# Altium project elstm32f405_core.PrjPCB
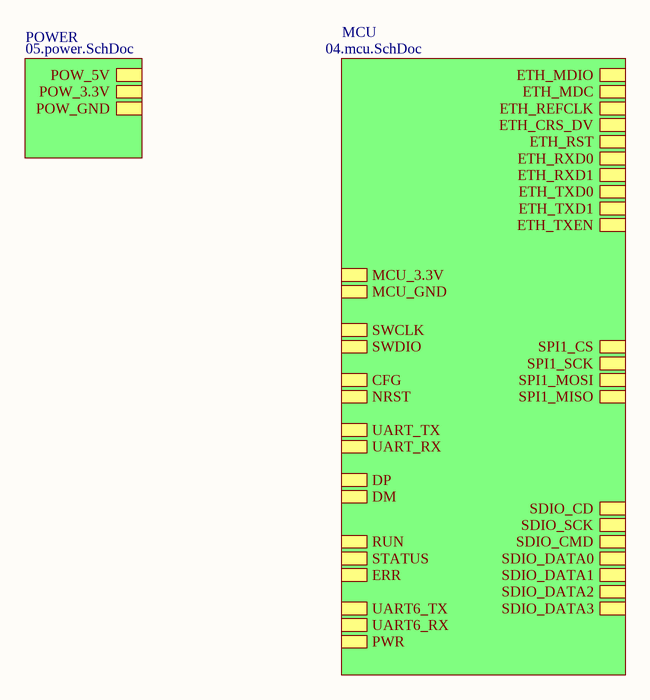
[diagram p0: 03.main.SchDoc]
5 sheets, 35 parts. Net scope: hierarchical (ports join the sheet entries above them; power ports are global).
Sheets:
  03.main.SchDoc
    MCU = 04.mcu.SchDoc
    POWER = 05.power.SchDoc
  06.other.SchDoc
  01.Block Diagram.SchDoc

## Sheet 03.main.SchDoc
size A4

### Sub-sheets
MCU = 04.mcu.SchDoc: SPI1_CS, SPI1_SCK, SPI1_MOSI, SPI1_MISO, SWCLK, SWDIO, CFG, NRST, DP, DM, UART_TX, UART_RX, SDIO_CD, SDIO_SCK, SDIO_CMD, SDIO_DATA0, SDIO_DATA1, SDIO_DATA2, SDIO_DATA3, RUN, ERR, STATUS, MCU_3.3V, MCU_GND, ETH_MDIO, ETH_MDC, ETH_CRS_DV, ETH_RST, ETH_RXD0, ETH_RXD1, ETH_TXD0, ETH_TXD1, ETH_TXEN, ETH_REFCLK, UART6_TX, UART6_RX, PWR
POWER = 05.power.SchDoc: POW_5V, POW_3.3V, POW_GND

### Nets
GND: sheet MCU/MCU_GND, sheet POWER/POW_GND

### Notes on the sheet
- #
- 日期
- 描述
- DESIGN BY
- 设计人员
- 设计日期
- 图纸名称
- 图纸描述
- EasyLinker Develop Team
- 审核人员
- 审核日期
- 产品名称
- 产品型号
- 图纸版本
- /
- A4

## Sheet 04.mcu.SchDoc
size A4
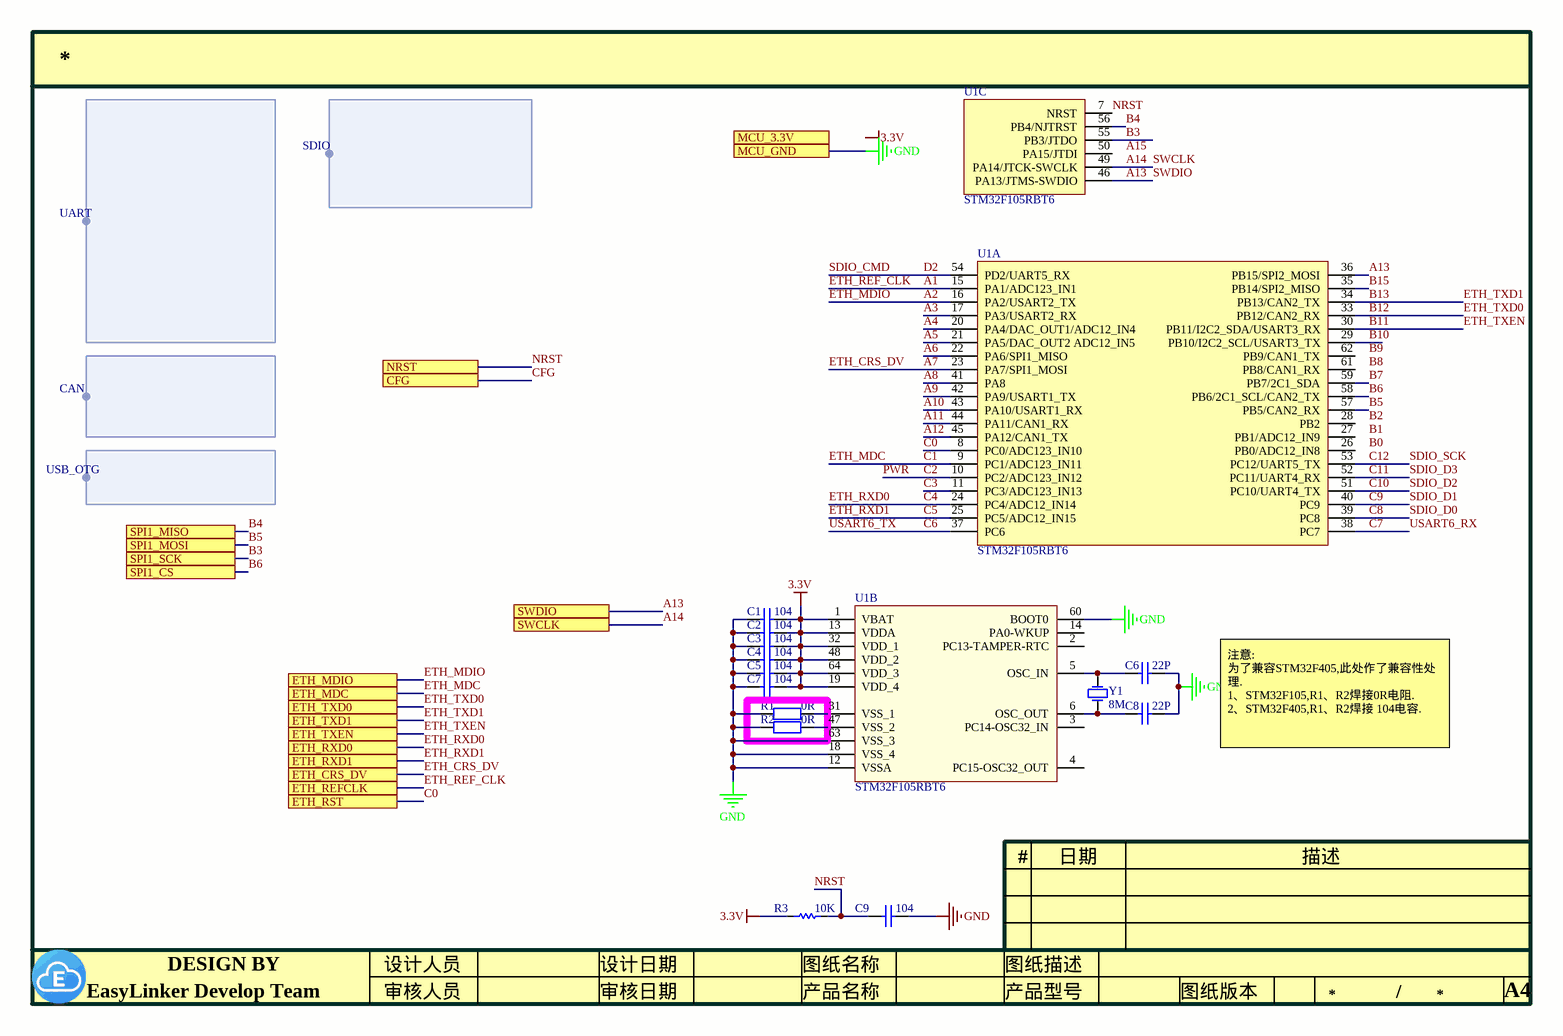
[diagram p1: 04.mcu.SchDoc]

### Parts
C1  104  [0603C]
C2  104  [0603C]
C3  104  [0603C]
C4  104  [0603C]
C5  104  [0603C]
C6  22P  [0603C]
C7  104  [0603C]
C8  22P  [0603C]
C9  104  [0603C]
R1  value 0R  [0603R]  (hidden comment: Res2)
R2  value 0R  [0603R]  (hidden comment: Res2)
R3  10K  [0603R]
U1  STM32F105RBT6  [S-PQFP-G64_Y]  (parts A,B,C of 3)
Y1  8M  [XTAL_SMD_5X3]

### Ports
CAN1_RX, CAN1_TX, CAN2_RX, CAN2_TX, CFG, DM (out), DP (out), ETH_CRS_DV, ETH_MDC, ETH_MDIO, ETH_REFCLK, ETH_RST, ETH_RXD0, ETH_RXD1, ETH_TXD0, ETH_TXD1, ETH_TXEN, MCU_3.3V, MCU_GND, NRST, SDIO_CD, SDIO_CMD, SDIO_DATA0, SDIO_DATA1, SDIO_DATA2, SDIO_DATA3, SDIO_SCK, SPI1_CS, SPI1_MISO, SPI1_MOSI, SPI1_SCK, SWCLK, SWDIO, UART1_RX, UART1_TX, UART2_RX, UART2_TX, UART3_RX, UART3_TX, UART4_RX, UART4_TX, UART5_RX, UART5_TX, UART6_RX, UART6_TX

### Harnesses
UART: 
CAN: 
USB_OTG: 
SDIO: 

### Nets
3.3V: C1.1 C2.1 C3.1 C4.1 C5.1 C7.1 R3.1 U1.1(VBAT) U1.13(VDDA) U1.19(VDD_4) U1.32(VDD_1) U1.48(VDD_2) U1.64(VDD_3)
GND: C1.2 C2.2 C3.2 C4.2 C5.2 C6.1 C7.2 C8.1 C9.1 R1.2 R2.2 U1.12(VSSA) U1.18(VSS_4) U1.60(BOOT0) U1.63(VSS_3) ; port MCU_GND
A1: U1.15(PA1/ADC123_IN1) ; port ETH_REFCLK  [also labelled ETH_REF_CLK]
A2: U1.16(PA2/USART2_TX) ; port ETH_MDIO, port UART2_TX  [also labelled ETH_MDIO]
A3: U1.17(PA3/USART2_RX) ; port UART2_RX
A4: U1.20(PA4/DAC_OUT1/ADC12_IN4)
A5: U1.21(PA5/DAC_OUT2_ADC12_IN5)
A6: U1.22(PA6/SPI1_MISO)
A7: U1.23(PA7/SPI1_MOSI) ; port ETH_CRS_DV  [also labelled ETH_CRS_DV]
A8: U1.41(PA8)
A9: U1.42(PA9/USART1_TX) ; port UART1_TX
A10: U1.43(PA10/USART1_RX) ; port UART1_RX
A11: U1.44(PA11/CAN1_RX) ; port DM
A12: U1.45(PA12/CAN1_TX) ; port DP
A13: U1.36(PB15/SPI2_MOSI) U1.46(PA13/JTMS-SWDIO) ; port SWDIO  [also labelled SWDIO]
A14: U1.49(PA14/JTCK-SWCLK) ; port SWCLK  [also labelled SWCLK]
B3: U1.55(PB3/JTDO) ; port SPI1_SCK
B4: U1.56(PB4/NJTRST) ; port SPI1_MISO
B5: U1.57(PB5/CAN2_RX) ; port SPI1_MOSI, port CAN2_RX
B6: U1.58(PB6/2C1_SCL/CAN2_TX) ; port SPI1_CS, port CAN2_TX
B7: U1.59(PB7/2C1_SDA)
B8: port CAN1_RX
B9: port CAN1_TX
B10: U1.29(PB10/I2C2_SCL/USART3_TX) ; port UART3_TX
B11: U1.30(PB11/I2C2_SDA/USART3_RX) ; port ETH_TXEN, port UART3_RX  [also labelled ETH_TXEN]
B12: U1.33(PB12/CAN2_RX) ; port ETH_TXD0  [also labelled ETH_TXD0]
B13: U1.34(PB13/CAN2_TX) ; port ETH_TXD1  [also labelled ETH_TXD1]
B15: U1.35(PB14/SPI2_MISO)
C0: U1.8(PC0/ADC123_IN10) ; port ETH_RST
C1: U1.9(PC1/ADC123_IN11) ; port ETH_MDC  [also labelled ETH_MDC]
C2: U1.10(PC2/ADC123_IN12) ; port SDIO_CD  [also labelled PWR]
C3: U1.11(PC3/ADC123_IN13)
C4: U1.24(PC4/ADC12_IN14) ; port ETH_RXD0  [also labelled ETH_RXD0]
C5: U1.25(PC5/ADC12_IN15) ; port ETH_RXD1  [also labelled ETH_RXD1]
C6: U1.37(PC6) ; port UART6_TX  [also labelled USART6_TX]
C7: U1.38(PC7) ; port UART6_RX  [also labelled USART6_RX]
C8: U1.39(PC8) ; port SDIO_DATA0  [also labelled SDIO_D0]
C9: U1.40(PC9) ; port SDIO_DATA1  [also labelled SDIO_D1]
C10: U1.51(PC10/UART4_TX) ; port SDIO_DATA2, port UART4_TX  [also labelled SDIO_D2]
C11: U1.52(PC11/UART4_RX) ; port SDIO_DATA3, port UART4_RX  [also labelled SDIO_D3]
C12: U1.53(PC12/UART5_TX) ; port SDIO_SCK, port UART5_TX  [also labelled SDIO_SCK]
CFG: port CFG
D2: U1.54(PD2/UART5_RX) ; port SDIO_CMD, port UART5_RX  [also labelled SDIO_CMD]
NRST: C9.2 R3.2 U1.7(NRST) ; port NRST
NetC6_2: C6.2 U1.5(OSC_IN) Y1.1(OSC1)
NetC8_2: C8.2 U1.6(OSC_OUT) Y1.2(OSC2)
NetR1_1: R1.1 U1.31(VSS_1)
NetR2_1: R2.1 U1.47(VSS_2)

Not connected (* = marked no-connect by the designer): U1 2(PC13-TAMPER-RTC) 3(PC14-OSC32_IN) 4(PC15-OSC32_OUT) 14(PA0-WKUP) 26(PB0/ADC12_IN8) 27(PB1/ADC12_IN9) 28(PB2) 50(PA15/JTDI) 61(PB8/CAN1_RX) 62(PB9/CAN1_TX)

### Notes on the sheet
- 注意:
  为了兼容STM32F405,此处作了兼容性处理.
  1、STM32F105,R1、R2焊接0R电阻.
  2、STM32F405,R1、R2焊接 104电容.
- Labels drawn without touching a wire or pin: 3.3V, A15, B0, B1, B2, B8, B9
- #
- 日期
- 描述
- DESIGN BY
- 设计人员
- 设计日期
- 图纸名称
- 图纸描述
- EasyLinker Develop Team
- 审核人员
- 审核日期
- 产品名称
- 产品型号
- 图纸版本
- /
- A4

### Library data of the parts
C1-C9 = Cap: Capacitor; Published: 8-Jun-2000; LatestRevisionDate: 17-Jul-2002; LatestRevisionNote: Re-released for DXP Platform.; PackageReference: RAD-0.3; Publisher: Altium Limited; PackageDescription: Radial Cap, Thru-Hole; 2 Leads; 0.3 in Pin Spacing
  C1-C5 C7 C9: Value: 104
  C6 C8: Value: 22P
R1 R2 = Res2: Resistor; Published: 8-Jun-2000; LatestRevisionDate: 17-Jul-2002; LatestRevisionNote: Re-released for DXP Platform.; PackageReference: AXIAL-0.4; Publisher: Altium Limited; PackageDescription: Axial Device, Thru-Hole; 2 Leads; 0.4 in Pin Spacing
R3 = Res1: Resistor; Published: 8-Jun-2000; LatestRevisionDate: 17-Jul-2002; LatestRevisionNote: Re-released for DXP Platform.; PackageReference: AXIAL-0.3; Publisher: Altium Limited; PackageDescription: Axial Device, Thru-Hole; 2 Leads; 0.3 in Pin Spacing; Value: 10K
U1 = STM32F105xxx-64-QFP64
Y1 = XTAL: Crystal Oscillator; Published: 8-Jun-2000; LatestRevisionDate: 17-Jul-2002; LatestRevisionNote: Re-released for DXP Platform.; PackageReference: R38; Publisher: Altium Limited; PackageDescription: Crystal, Thru-Hole; 2 Leads; Body 3.1 x 8.2 mm (Dia.xH)

## Sheet 05.power.SchDoc
size A4
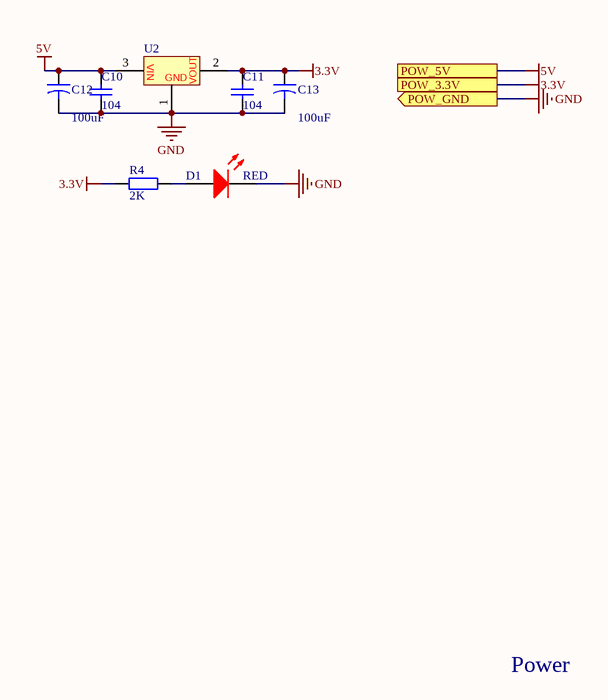
[diagram p2: 05.power.SchDoc]

### Parts
C10  104  [0603C]
C11  104  [0603C]
C12  value 100uF  [3216]  (hidden comment: Cap2)
C13  value 100uF  [3216]  (hidden comment: Cap2)
D1  RED  [0603led]
R4  value 2K  [0603R]  (hidden comment: Res2)
U2  (no value)  [sot-89]

### Ports
POW_3.3V, POW_5V, POW_GND (out)

### Nets
3.3V: C11.2 C13.1 R4.1 U2.2(VOUT) ; port POW_3.3V
5V: C10.2 C12.1 U2.3(VIN) ; port POW_5V
GND: C10.1 C11.1 C12.2 C13.2 D1.2 U2.1(GND) ; port POW_GND
NetD1_1: D1.1 R4.2

### Notes on the sheet
- Power
- #
- 日期
- 描述
- DESIGN BY
- 设计人员
- 设计日期
- 图纸名称
- 图纸描述
- EasyLinker Develop Team
- 审核人员
- 审核日期
- 产品名称
- 产品型号
- 图纸版本
- /
- A4

### Library data of the parts
C10 C11 = Cap: Capacitor; Published: 8-Jun-2000; LatestRevisionDate: 17-Jul-2002; LatestRevisionNote: Re-released for DXP Platform.; PackageReference: RAD-0.3; Publisher: Altium Limited; PackageDescription: Radial Cap, Thru-Hole; 2 Leads; 0.3 in Pin Spacing; Value: 104
C12 C13 = Cap2: Capacitor; Published: 23-Sep-2002; PackageReference: CAPR5-4X5; Publisher: Altium Limited; PackageDescription: Capacitor; 2 Leads
D1 = LED_RED: Typical RED; Published: 8-Jun-2000; LatestRevisionDate: 17-Jul-2002; LatestRevisionNote: Re-released for DXP Platform.; PackageVersion: Feb-2002; PackageReference: 3.2X1.6X1.1; Publisher: Altium Limited; PackageDescription: SM LED; 2 Flat Leads
R4 = Res2: Resistor; Published: 8-Jun-2000; LatestRevisionDate: 17-Jul-2002; LatestRevisionNote: Re-released for DXP Platform.; PackageReference: AXIAL-0.4; Publisher: Altium Limited; PackageDescription: Axial Device, Thru-Hole; 2 Leads; 0.4 in Pin Spacing
U2 = AMS1117

## Sheet 06.other.SchDoc
size A4
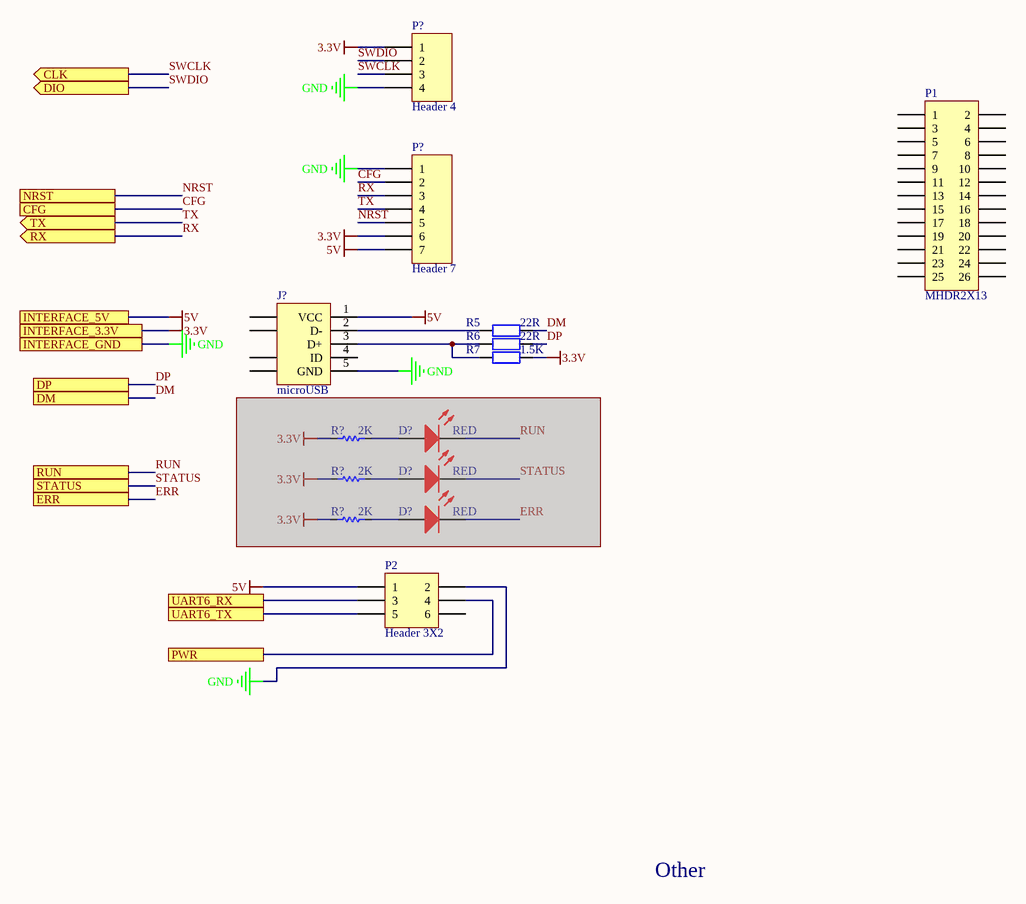
[diagram p3: 06.other.SchDoc]

### Parts
(Parts that share a designator on the sheet are numbered #1, #2 ... from top to bottom, then left to right.)
D?#1  RED  [0603led]  (masked out: inside a compile mask, not in the netlist)
D?#2  RED  [0603led]  (masked out: inside a compile mask, not in the netlist)
D?#3  RED  [0603led]  (masked out: inside a compile mask, not in the netlist)
J?  microUSB  [USB-Micro-DIP]
P1  MHDR2X13  [MHDR2X13]
P2  Header 3X2  [HDR2X3]
P?#1  Header 4  [HDR1X4]
P?#2  Header 7  [HDR1X7]
R5  value 22R  [0603R]  (hidden comment: Res2)
R6  value 22R  [0603R]  (hidden comment: Res2)
R7  value 1.5K  [0603R]  (hidden comment: Res2)
R?#1  2K  [0603R]  (masked out: inside a compile mask, not in the netlist)
R?#2  2K  [0603R]  (masked out: inside a compile mask, not in the netlist)
R?#3  2K  [0603R]  (masked out: inside a compile mask, not in the netlist)

### Ports
CFG, CLK (out), DIO (out), DM, DP, ERR, INTERFACE_3.3V, INTERFACE_5V, INTERFACE_GND, NRST, PWR, RUN, RX (out), STATUS, TX (out), UART6_RX, UART6_TX

### Nets
3.3V: P?#1.1 P?#2.6 R7.1 ; port INTERFACE_3.3V
5V: J?.1(VCC) P2.1 P?#2.7 ; port INTERFACE_5V
GND: J?.5(GND) P2.2 P?#1.4 P?#2.1 ; port INTERFACE_GND
CFG: P?#2.2 ; port CFG
DM: R5.1 ; port DM
DP: R6.1 ; port DP
ERR: port ERR
NRST: P?#2.5 ; port NRST
RUN: port RUN
RX: P?#2.3 ; port RX
STATUS: port STATUS
SWCLK: P?#1.3 ; port CLK
SWDIO: P?#1.2 ; port DIO
TX: P?#2.4 ; port TX
NetJ?_2: J?.2(D-) R5.2
NetJ?_3: J?.3(D+) R6.2 R7.2
NetP2_3: P2.3 ; port UART6_RX
NetP2_4: P2.4 ; port PWR
NetP2_5: P2.5 ; port UART6_TX

Not connected (* = marked no-connect by the designer): J? 4(ID) 6 7 8 9; P1 1 2 3 4 5 6 7 8 9 10 11 12 13 14 15 16 17 18 19 20 21 22 23 24 25 26; P2 6

### Notes on the sheet
- Other
- #
- 日期
- 描述
- DESIGN BY
- 设计人员
- 设计日期
- 图纸名称
- 图纸描述
- EasyLinker Develop Team
- 审核人员
- 审核日期
- 产品名称
- 产品型号
- 图纸版本
- /
- A4

### Library data of the parts
D?#1-D?#3 = LED_RED: Typical RED; Published: 8-Jun-2000; LatestRevisionDate: 17-Jul-2002; LatestRevisionNote: Re-released for DXP Platform.; PackageVersion: Feb-2002; PackageReference: 3.2X1.6X1.1; Publisher: Altium Limited; PackageDescription: SM LED; 2 Flat Leads
J? = USB-micro
P1 = MHDR2X13: Header, 13-Pin, Dual row; LatestRevisionDate: 17-Jul-2002; LatestRevisionNote: Re-released for DXP Platform.; Publisher: Altium Limited
P2 = Header 3X2: Header, 3-Pin, Dual row; LatestRevisionDate: 17-Jul-2002; LatestRevisionNote: Re-released for DXP Platform.; Publisher: Altium Limited
P?#1 = Header 4: Header, 4-Pin; LatestRevisionDate: 17-Jul-2002; LatestRevisionNote: Re-released for DXP Platform.; Publisher: Altium Limited
P?#2 = Header 7: Header, 7-Pin; LatestRevisionDate: 17-Jul-2002; LatestRevisionNote: Re-released for DXP Platform.; Publisher: Altium Limited
R5-R7 = Res2: Resistor; Published: 8-Jun-2000; LatestRevisionDate: 17-Jul-2002; LatestRevisionNote: Re-released for DXP Platform.; PackageReference: AXIAL-0.4; Publisher: Altium Limited; PackageDescription: Axial Device, Thru-Hole; 2 Leads; 0.4 in Pin Spacing
R?#1-R?#3 = Res1: Resistor; Published: 8-Jun-2000; LatestRevisionDate: 17-Jul-2002; LatestRevisionNote: Re-released for DXP Platform.; PackageReference: AXIAL-0.3; Publisher: Altium Limited; PackageDescription: Axial Device, Thru-Hole; 2 Leads; 0.3 in Pin Spacing; Value: 2K

## Sheet 01.Block Diagram.SchDoc
size A4
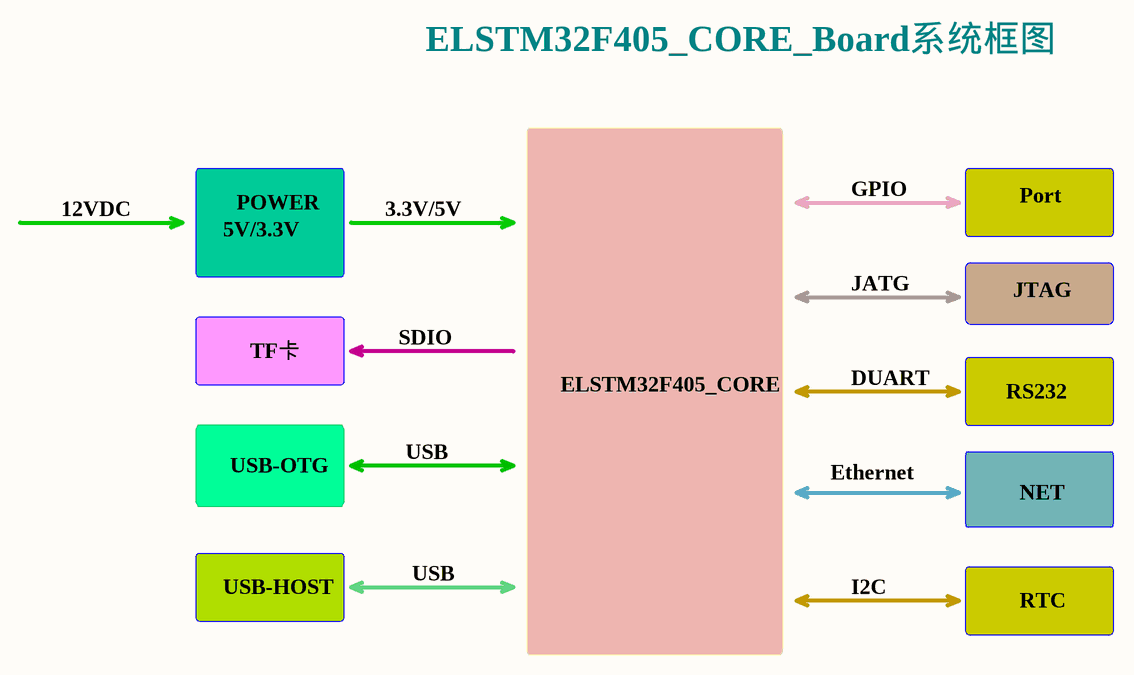
[diagram p4: 01.Block Diagram.SchDoc]

### Notes on the sheet
- ELSTM32F405_CORE_Board系统框图
- GPIO
- Port
- 12VDC
- 5V/3.3V
- POWER
- 3.3V/5V
- JATG
- JTAG
- TF卡
- SDIO
- ELSTM32F405_CORE
- DUART
- RS232
- USB-OTG
- USB
- Ethernet
- NET
- USB-HOST
- I2C
- RTC
- #
- 日期
- 描述
- DESIGN BY
- 设计人员
- 设计日期
- 图纸名称
- 图纸描述
- EasyLinker Develop Team
- 审核人员
- 审核日期
- 产品名称
- 产品型号
- 图纸版本
- /
- A4

## Nets that join several sheets
3.3V: 04.mcu (13 pins), 05.power (C11.2 C13.1 R4.1 U2.2), 06.other (P?#1.1 P?#2.6 R7.1)
5V: 05.power (C10.2 C12.1 U2.3), 06.other (J?.1 P2.1 P?#2.7)
GND: 04.mcu (15 pins), 05.power (6 pins), 06.other (J?.5 P2.2 P?#1.4 P?#2.1)